# Altium schematic sheet Sheet2.SchDoc
size A; SheetNumber: 2; SheetTotal: 2
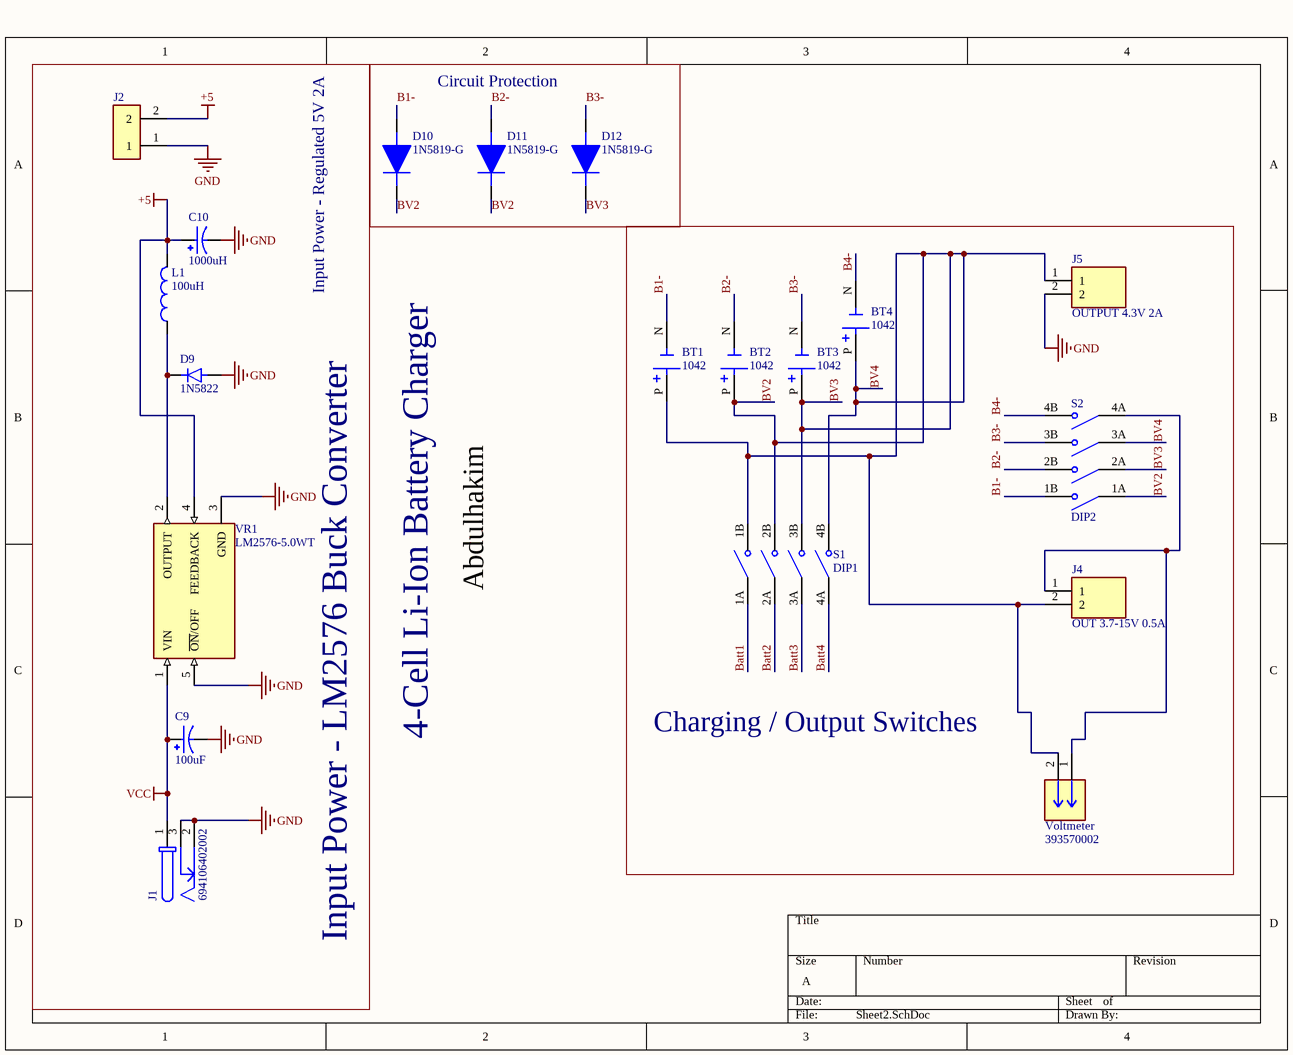
[diagram p0: Sheet2.SchDoc]

## Parts
BT1  1042  [BAT_1042]
BT2  1042  [BAT_1042]
BT3  1042  [BAT_1042]
BT4  1042  [BAT_1042]
C9  100uF  [CAP_EEEFKV101XAV]
C10  1000uH  [CAP_EEEFK0J102AV]
D9  1N5822  [DIOAD1990W125L900D530]
D10  1N5819-G  [DIOAD1405W75L465D235]
D11  1N5819-G  [DIOAD1405W75L465D235]
D12  1N5819-G  [DIOAD1405W75L465D235]
J1  694106402002  [694106402002]
J2  Input Power - Regulated 5V 2A  [CUI_TB007-508-02BE]
J4  OUT 3.7-15V 0.5A  [CUI_TB007-508-02BE]
J5  OUTPUT 4.3V 2A  [CUI_TB007-508-02BE]
L1  100uH  [WE-SI_744132]
S1  DIP1  [SW_DS01C-254-L-04BE]
S2  DIP2  [SW_DS01C-254-L-04BE]
Voltmeter  393570002  [CONN_393570002_MOL]
VR1  LM2576-5.0WT  [TO170P1016X444X1572-5]

## Blocks framed on the sheet
Input Power - LM2576 Buck Converter: C9 C10 D9 J1 J2 L1 VR1
Circuit Protection: D10-D12
Charging / Output Switches: BT1-BT4 J4 J5 S1 S2 Voltmeter

## Nets
+5: C10.1 J2.2 L1.2 VR1.4(FEEDBACK)
GND: C9.2 C10.2 D9.A J1.2 J1.3 J2.1 J5.2 VR1.3(GND) VR1.5(~{ON}/OFF)
VCC: C9.1 J1.1 VR1.1(VIN)
B1-: BT1.N(NEG) D10.2(A) S2.1B(NO1)
B2-: BT2.N(NEG) D11.2(A) S2.2B(NO2)
B3-: BT3.N(NEG) D12.2(A) S2.3B(NO3)
B4-: BT4.N(NEG) S2.4B(NO4)
Batt1: S1.1A(COM1)
Batt2: S1.2A(COM2)
Batt3: S1.3A(COM3)
Batt4: S1.4A(COM4)
BV2: BT1.P(POS) BT2.P(POS) BT3.P(POS) BT4.P(POS) D10.1(K) D11.1(K) D12.1(K) J4.2 J5.1 S1.1B(NO1) S1.2B(NO2) S1.3B(NO3) S1.4B(NO4) S2.1A(COM1) S2.2A(COM2) S2.3A(COM3) Voltmeter.2  [also labelled BV3, BV4]
NetD9_C: D9.C(K) L1.1 VR1.2(OUTPUT)
NetJ4_1: J4.1 S2.4A(COM4) Voltmeter.1

## Notes on the sheet
- Abdulhakim
- (near D10) 4-Cell Li-Ion Battery Charger

## Library data of the parts
BT1-BT4 = 1042: SMT Holder for 18650 Battery; MF: Keystone Electronics Corp.; SnapEDA_Link: https://www.snapeda.com/parts/1042/Keystone/view-part/?ref=snap; Package: NON STANDARD-5 Keystone; Value: *; MP: 1042; Check_prices: https://www.snapeda.com/parts/1042/Keystone/view-part/?ref=eda
C9 = EEEFKV101XAV: CAP ALUM 100UF 20% 35V SMD; MF: Panasonic; SnapEDA_Link: https://www.snapeda.com/parts/EEEFKV101XAV/Panasonic/view-part/?ref=snap; Purchase-URL: https://pricing.snapeda.com/search/part/EEEFKV101XAV/?ref=eda; Availability: In Stock; Price: None; Package: RADIAL-2 Panasonic; Check_prices: https://www.snapeda.com/parts/EEEFKV101XAV/Panasonic/view-part/?ref=eda; Value: *; MP: EEEFKV101XAV
C10 = EEEFK0J102AV: CAP ALUM 1000UF 20% 6.3V SMD; MF: Panasonic; Package: RADIAL-2 Panasonic; Purchase-URL: https://pricing.snapeda.com/search/part/EEEFK0J102AV/?ref=eda; Check_prices: https://www.snapeda.com/parts/EEEFK0J102AV/Panasonic/view-part/5793315/?ref=eda; Value: *; Price: None; MP: EEEFK0J102AV; Availability: In Stock; SnapEDA_Link: https://www.snapeda.com/parts/EEEFK0J102AV/Panasonic/view-part/5793315/?ref=snap
D9 = 1N5822: 3A, 40V, DÃ¼zlemsel Schottky; MF: Taiwan Semiconductor; SnapEDA_Link: https://www.snapeda.com/parts/1N5822/taiwan/view-part/?ref=snap; Package: DO-201AD Taiwan Semiconductor; Value: *; MP: 1N5822; Check_prices: https://www.snapeda.com/parts/1N5822/taiwan/view-part/?ref=eda
D10-D12 = 1N5819-G: Diode,Schottky Barrier,Vr 40V,If 1A,Pkg CASE 59-10,Vf 0.6V,Tj +125degc,Cs 25A | ON Semiconductor 1N5819G; SnapEDA_Link: https://www.snapeda.com/parts/1N5819G/Onsemi/view-part/?ref=snap; Package: DO-41 onsemi; Value: *; MF: ON Semiconductor; MP: 1N5819G; Check_prices: https://www.snapeda.com/parts/1N5819G/Onsemi/view-part/?ref=eda
J1 = CMP-1502-00189-3: DC Power Jack Connector WR-DC, Male, Vertical, THT, 3 A, 20 V; Voltage Rating: 30V; Shielding: Unshielded; Operating Supply Voltage: 20V; Current Rating: 3A; Number of Contacts: 1; Insulation Resistance: 100MΩ; Max Operating Temperature: 85°C; Height: 14.3mm; Orientation: Vertical; REACH SVHC: Unknown; RoHS: Compliant; Min Operating Temperature: -40°C; Termination: Through Hole; Contact Material: Gold; Flammability Rating: UL94 V-0; Voltage Rating (DC): 20V; Housing Material: Polyamide; Mount: Through Hole; Connector Type: Power; Contact Gender: Female; Color: Black; Gender: Male; Contact Plating: Tin; Packaging: Bulk
J2 = TB007-508-02BE: 2 Position Wire to Board Terminal Block Horizontal with Board 0.200 (5.08mm) Through Hole; MF: Same Sky; MP: TB00750802BE; SnapEDA_Link: https://www.snapeda.com/parts/TB00750802BE/Same+Sky/view-part/?ref=snap; Package: None; Value: *; Check_prices: https://www.snapeda.com/parts/TB00750802BE/Same+Sky/view-part/?ref=eda
J4 J5 = TB007-508-02BE: 2~24 Poles, Screw Type, Horizontal, 5.08 Pitch, 24~12 (AWG), Terminal Block Connector; MF: Same Sky; SnapEDA_Link: https://www.snapeda.com/parts/TB007-508-02BE/Same+Sky/view-part/?ref=snap; Package: None; Value: *; MP: TB007-508-02BE; Check_prices: https://www.snapeda.com/parts/TB007-508-02BE/Same+Sky/view-part/?ref=eda
L1 = WE-SI: L = 49 ÂµH ; IR = 5.8 A; Isat = 2.2 A; RDC = 0.05 â„¦; MF: Wurth Elektronik; MP: 744132; SnapEDA_Link: https://www.snapeda.com/parts/744132/Wurth+Electronics/view-part/?ref=snap; Package: None; Value: *; Check_prices: https://www.snapeda.com/parts/744132/Wurth+Electronics/view-part/?ref=eda
S1 S2 = DS01C-254-L-04BE: 4 Position, Through Hole, 2.54 mm Pitch, Raised Slide Actuator, Convex Bottom, Long Pin, DIP Switch; MF: Same Sky; SnapEDA_Link: https://www.snapeda.com/parts/DS01C-254-L-04BE/Same+Sky/view-part/?ref=snap; Package: None; Value: *; MP: DS01C-254-L-04BE; Check_prices: https://www.snapeda.com/parts/DS01C-254-L-04BE/Same+Sky/view-part/?ref=eda
Voltmeter = 393570002: TB, WIRE TO BRD, 2POS, 16AWG; Pitch Spacing:3.5mm; No. of Positions:2Ways; Wire Size AWG Min:28AWG; Wire Size AWG Max:16AWG; Conductor Area CSA:1mmÂ²; Wire Connection Method:Screw; Rated Current:17.5A; Rated Voltage:300V; Block Orientation:Through Hole Ri; MF: Molex; SnapEDA_Link: https://www.snapeda.com/parts/393570002/Molex/view-part/?ref=snap; Package: None; Value: *; MP: 393570002; Check_prices: https://www.snapeda.com/parts/393570002/Molex/view-part/?ref=eda
VR1 = LM2576-5.0WT: Buck Switching Regulator IC Positive Fixed 5V 1 Output 3A TO-220-5; MF: Microchip Technology; SnapEDA_Link: https://www.snapeda.com/parts/LM2576-5.0WT/Microchip/view-part/?ref=snap; Package: TO-220-5 Micrel; Value: *; MP: LM2576-5.0WT; Check_prices: https://www.snapeda.com/parts/LM2576-5.0WT/Microchip/view-part/?ref=eda